# Altium schematic sheet Sheet1.SchDoc
size A3
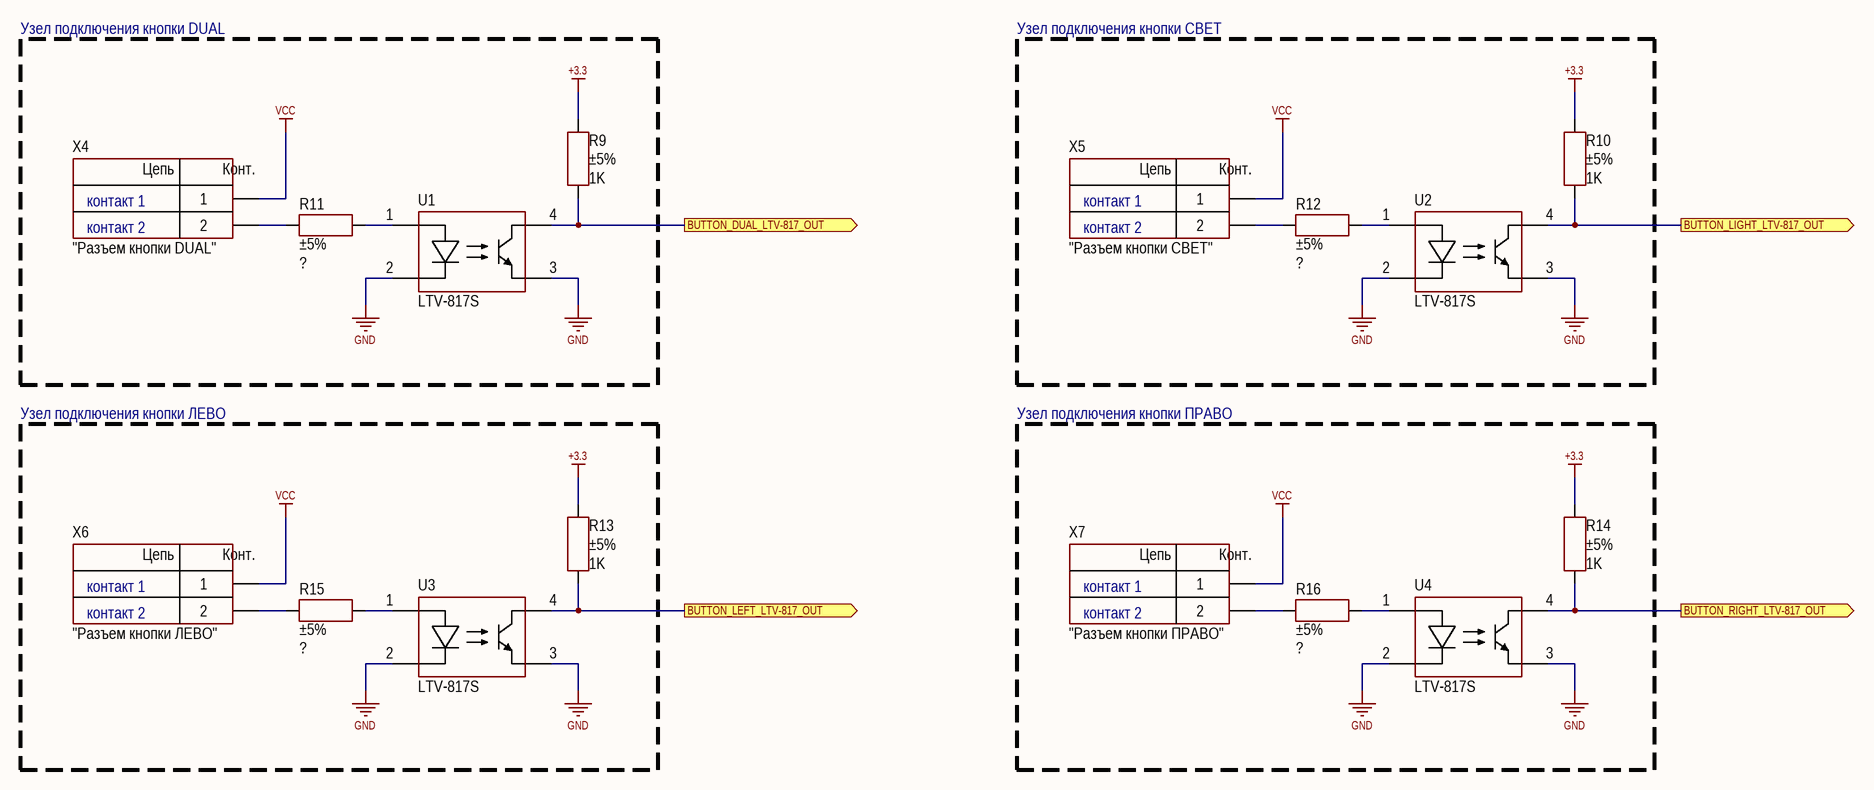
[diagram p0: Sheet1.SchDoc]

## Parts
R9  value 1K  Tolerance: ±5%  [RES: 0603]
R10  value 1K  Tolerance: ±5%  [RES: 0603]
R11  Tolerance: ±5%  [RES: 0603]
R12  Tolerance: ±5%  [RES: 0603]
R13  value 1K  Tolerance: ±5%  [RES: 0603]
R14  value 1K  Tolerance: ±5%  [RES: 0603]
R15  Tolerance: ±5%  [RES: 0603]
R16  Tolerance: ±5%  [RES: 0603]
U1  PartNumber: LTV-817S  [4-SMD]
U2  PartNumber: LTV-817S  [4-SMD]
U3  PartNumber: LTV-817S  [4-SMD]
U4  PartNumber: LTV-817S  [4-SMD]
X4  CommentText: "Разъем кнопки DUAL"  [CON: DG350-3.5-02P]
X5  CommentText: "Разъем кнопки СВЕТ"  [CON: DG350-3.5-02P]
X6  CommentText: "Разъем кнопки ЛЕВО"  [CON: DG350-3.5-02P]
X7  CommentText: "Разъем кнопки ПРАВО"  [CON: DG350-3.5-02P]

## Ports
BUTTON_DUAL_LTV-817_OUT (out), BUTTON_LEFT_LTV-817_OUT (out), BUTTON_LIGHT_LTV-817_OUT (out), BUTTON_RIGHT_LTV-817_OUT (out)

## Nets
+3.3: R9.2 R10.2 R13.2 R14.2
GND: U1.2(C) U1.3(E) U2.2(C) U2.3(E) U3.2(C) U3.3(E) U4.2(C) U4.3(E)
VCC: X4.1 X5.1 X6.1 X7.1
BUTTON_DUAL_LTV-817_OUT: R9.1 U1.4(C) ; port BUTTON_DUAL_LTV-817_OUT
BUTTON_LEFT_LTV-817_OUT: R13.1 U3.4(C) ; port BUTTON_LEFT_LTV-817_OUT
BUTTON_LIGHT_LTV-817_OUT: R10.1 U2.4(C) ; port BUTTON_LIGHT_LTV-817_OUT
BUTTON_RIGHT_LTV-817_OUT: R14.1 U4.4(C) ; port BUTTON_RIGHT_LTV-817_OUT
NetR11_1: R11.1 X4.2
NetR11_2: R11.2 U1.1(A)
NetR12_1: R12.1 X5.2
NetR12_2: R12.2 U2.1(A)
NetR15_1: R15.1 X6.2
NetR15_2: R15.2 U3.1(A)
NetR16_1: R16.1 X7.2
NetR16_2: R16.2 U4.1(A)

## Notes on the sheet
- Узел подключения кнопки DUAL
- Узел подключения кнопки СВЕТ
- контакт 1
- контакт 2
- Узел подключения кнопки ЛЕВО
- Узел подключения кнопки ПРАВО
- (in symbol Connector_terminal_2pin) Цепь; Конт.

## Library data of the parts
R9 R10 R13 R14 = Resistor_0603: Manufacturer: Yageo; PartNumber: RC0603JR-07100RL; ValueManufacturerPartNumber: Resistor film, 1K, ±5%, 0603, 0.1W, -55...+125°C; TypeResistor: Resistor film; Power: 0.1W; Package: 0603; HelpURL: https://www.digikey.com/product-detail/en/yageo/RC0603JR-07100RL/311-100GRCT-ND/729644; Temperature: -55...+125°C
R11 R12 R15 R16 = Resistor_0603: Manufacturer: Yageo; PartNumber: RC0603JR-07100RL; ValueManufacturerPartNumber: Resistor film, ?, ±5%, 0603, 0.1W, -55...+125°C; TypeResistor: Resistor film; Power: 0.1W; Package: 0603; HelpURL: https://www.digikey.com/product-detail/en/yageo/RC0603JR-07100RL/311-100GRCT-ND/729644; Temperature: -55...+125°C; Value: ?
U1-U4 = LTV-817: Optoisolator; Manufacturer: Lite-On; ValueManufacturerPartNumber: IC optoisolator, 4µs/3µs, 5000Vrms, 35V, -40...+125°C, 4-SMD; Supply: 35V; DataRate: 4µs/3µs; Isolation: 5000Vrms; HelpURL: https://www.digikey.com/product-detail/en/lite-on-inc/LTV-817S/160-1367-5-ND/385837; Package: 4-SMD; ComponentType: IC optoisolator; Temperature: -40...+125°C
X4-X7 = Connector_terminal_2pin: Manufacturer: Degson; ValueManufacturerPartNumber: Terminal connector, 2pin, 3.5mm, 300VAC, 10A; PartNumber: DG350-3.5-02P-14; TypeConnector: Terminal connector; VoltageMax: 300VAC; Pitch: 3.5mm; CurrentMax: 10A; Multichannel: 2pin; HelpURL: https://www.chipdip.ru/product/dg350-3.5-02p-12